# Altium schematic sheet CAMAC_v2.SchDoc
size A3
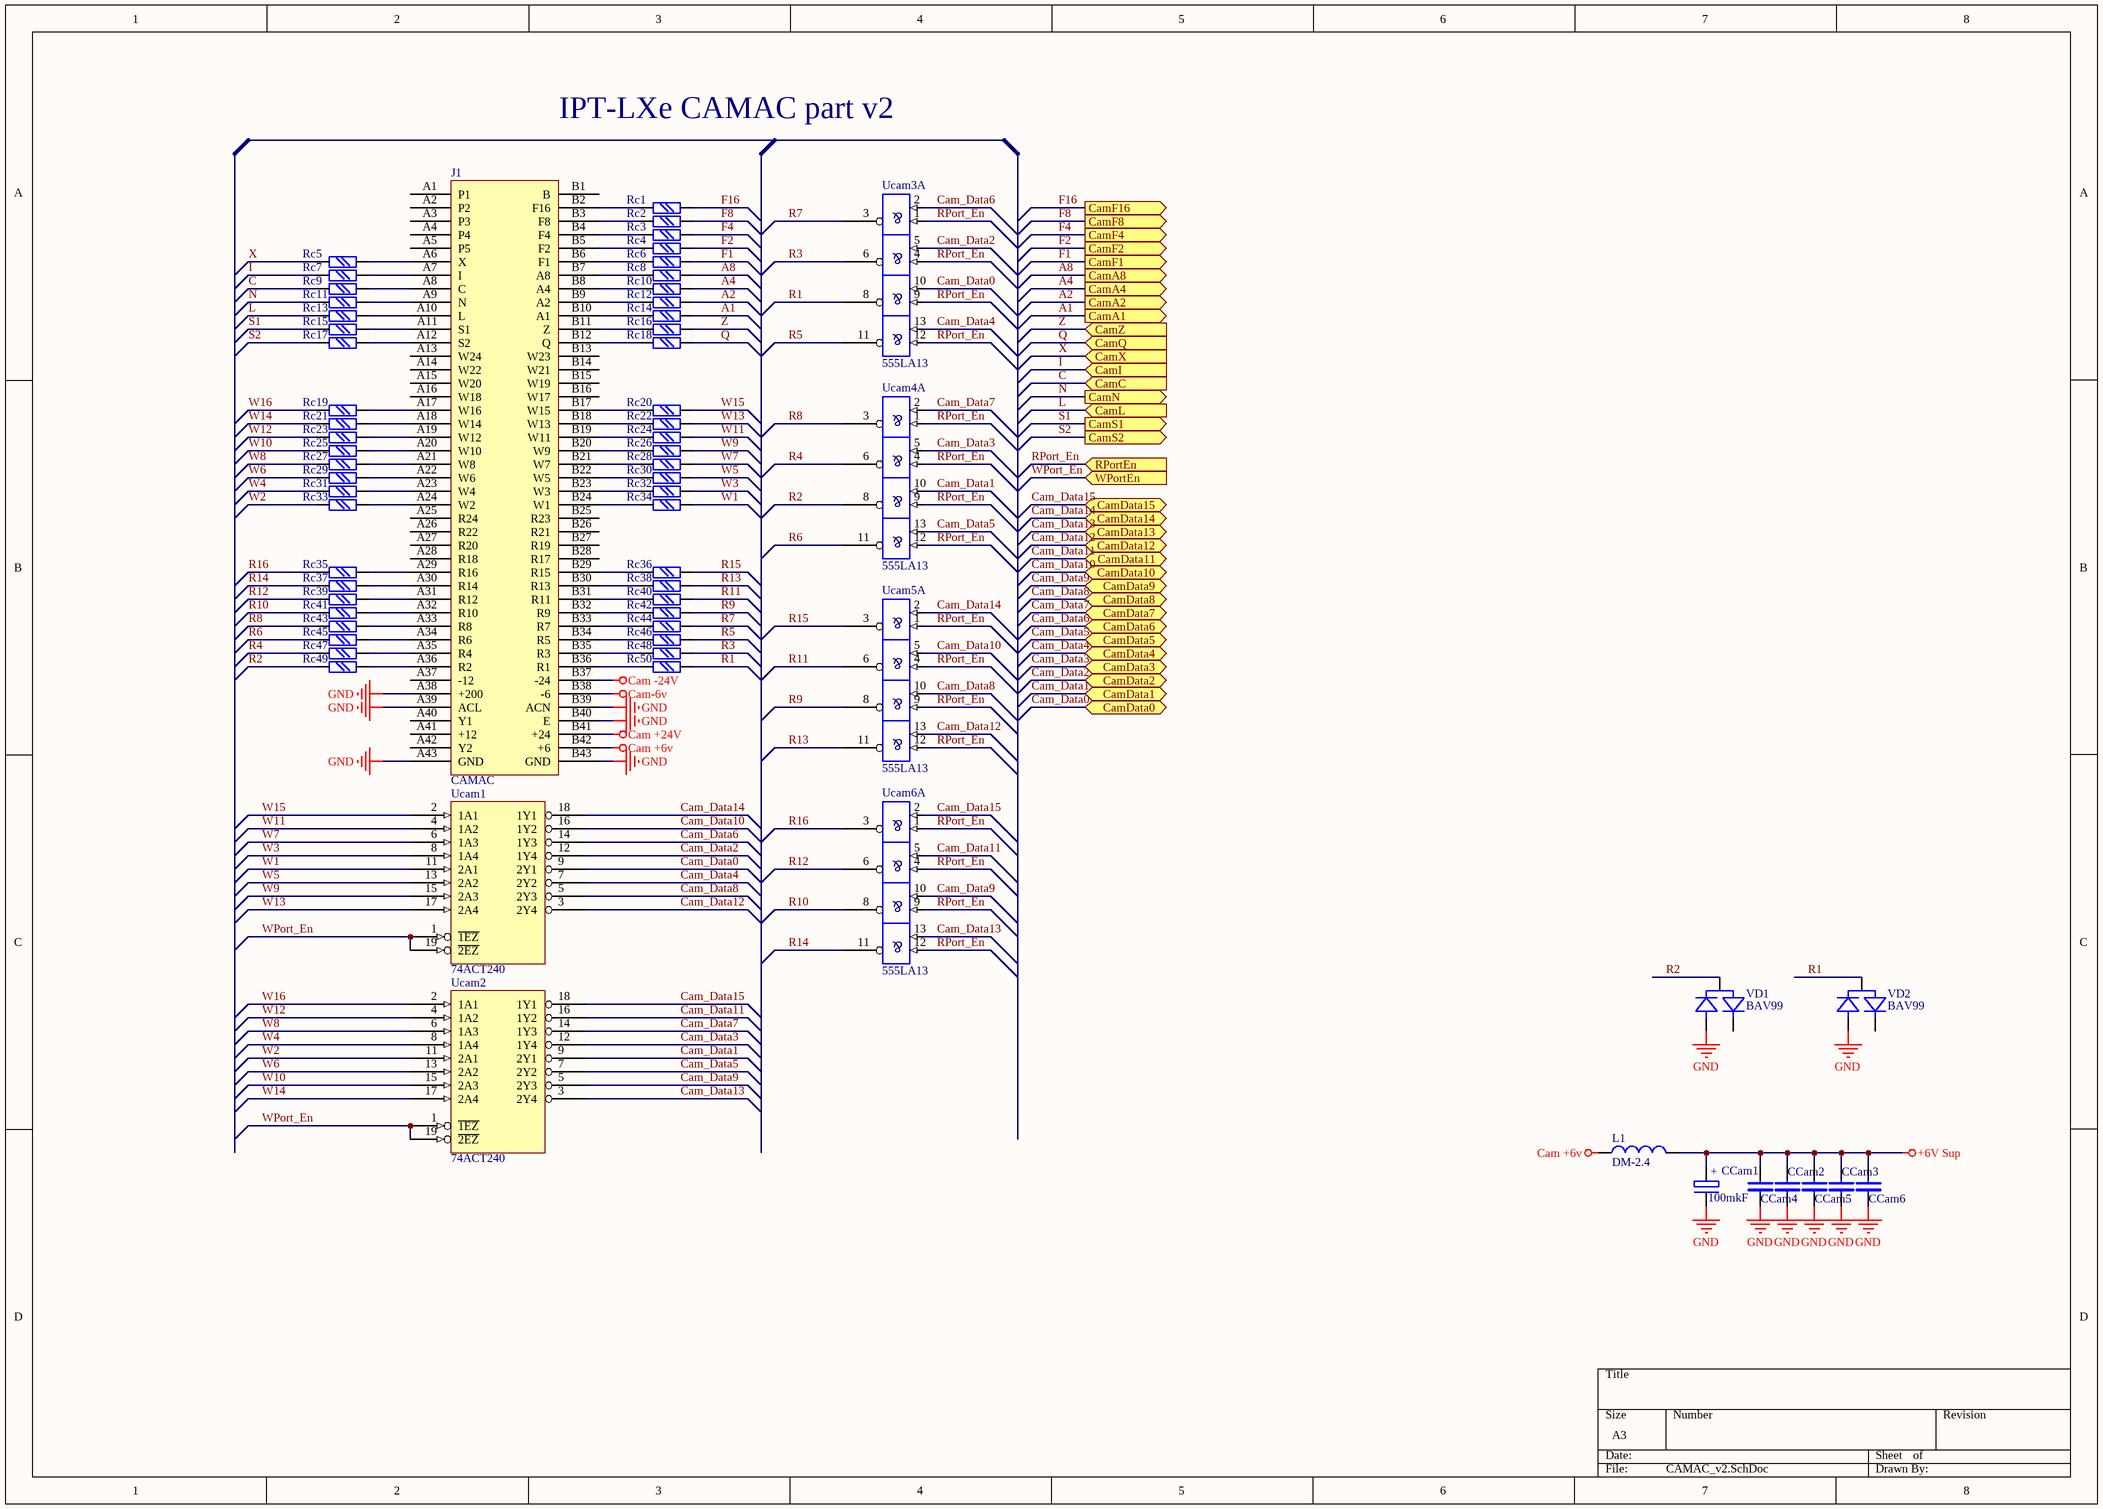
[diagram p0: CAMAC_v2.SchDoc]

## Parts
CCam1  100mkF  [CEL-SMD300]
CCam2  0.1uF  [chip0805]  (value not drawn)
CCam3  0.1uF  [chip0805]  (value not drawn)
CCam4  0.1uF  [chip0805]  (value not drawn)
CCam5  0.1uF  [chip0805]  (value not drawn)
CCam6  0.1uF  [chip0805]  (value not drawn)
J1  CAMAC  [CAMAC - duplicate]
L1  DM-2.4  [DM-2.4]
Rc1  R  [chip0805]  (value not drawn)
Rc2  R  [chip0805]  (value not drawn)
Rc3  R  [chip0805]  (value not drawn)
Rc4  R  [chip0805]  (value not drawn)
Rc5  R  [chip0805]  (value not drawn)
Rc6  R  [chip0805]  (value not drawn)
Rc7  R  [chip0805]  (value not drawn)
Rc8  R  [chip0805]  (value not drawn)
Rc9  R  [chip0805]  (value not drawn)
Rc10  R  [chip0805]  (value not drawn)
Rc11  R  [chip0805]  (value not drawn)
Rc12  R  [chip0805]  (value not drawn)
Rc13  R  [chip0805]  (value not drawn)
Rc14  R  [chip0805]  (value not drawn)
Rc15  R  [chip0805]  (value not drawn)
Rc16  R  [chip0805]  (value not drawn)
Rc17  R  [chip0805]  (value not drawn)
Rc18  R  [chip0805]  (value not drawn)
Rc19  R  [chip0805]  (value not drawn)
Rc20  R  [chip0805]  (value not drawn)
Rc21  R  [chip0805]  (value not drawn)
Rc22  R  [chip0805]  (value not drawn)
Rc23  R  [chip0805]  (value not drawn)
Rc24  R  [chip0805]  (value not drawn)
Rc25  R  [chip0805]  (value not drawn)
Rc26  R  [chip0805]  (value not drawn)
Rc27  R  [chip0805]  (value not drawn)
Rc28  R  [chip0805]  (value not drawn)
Rc29  R  [chip0805]  (value not drawn)
Rc30  R  [chip0805]  (value not drawn)
Rc31  R  [chip0805]  (value not drawn)
Rc32  R  [chip0805]  (value not drawn)
Rc33  R  [chip0805]  (value not drawn)
Rc34  R  [chip0805]  (value not drawn)
Rc35  R  [chip0805]  (value not drawn)
Rc36  R  [chip0805]  (value not drawn)
Rc37  R  [chip0805]  (value not drawn)
Rc38  R  [chip0805]  (value not drawn)
Rc39  R  [chip0805]  (value not drawn)
Rc40  R  [chip0805]  (value not drawn)
Rc41  R  [chip0805]  (value not drawn)
Rc42  R  [chip0805]  (value not drawn)
Rc43  R  [chip0805]  (value not drawn)
Rc44  R  [chip0805]  (value not drawn)
Rc45  R  [chip0805]  (value not drawn)
Rc46  R  [chip0805]  (value not drawn)
Rc47  R  [chip0805]  (value not drawn)
Rc48  R  [chip0805]  (value not drawn)
Rc49  R  [chip0805]  (value not drawn)
Rc50  R  [chip0805]  (value not drawn)
Ucam1  74ACT240  [20SOIC300]
Ucam2  74ACT240  [20SOIC300]
Ucam3  (no value)  [14DIP300]  (parts A,B,C,D of 4)
Ucam4  (no value)  [14DIP300]  (parts A,B,C,D of 4)
Ucam5  (no value)  [14DIP300]  (parts A,B,C,D of 4)
Ucam6  (no value)  [14DIP300]  (parts A,B,C,D of 4)
VD1  BAV99  [SOT23]
VD2  BAV99  [SOT23]

## Ports
CamA1 (out), CamA2 (out), CamA4 (out), CamA8 (out), CamC (in), CamData0 (bidir), CamData1 (bidir), CamData2 (bidir), CamData3 (bidir), CamData4 (bidir), CamData5 (bidir), CamData6 (bidir), CamData7 (bidir), CamData8 (bidir), CamData9 (bidir), CamData10 (bidir), CamData11 (bidir), CamData12 (bidir), CamData13 (bidir), CamData14 (bidir), CamData15 (bidir), CamF1 (out), CamF2 (out), CamF4 (out), CamF8 (out), CamF16 (out), CamI (in), CamL (in), CamN (out), CamQ (in), CamS1 (out), CamS2 (out), CamX (in), CamZ (in), RPortEn (in), WPortEn (in)

## Nets
+6V Sup: CCam1.+ CCam2.1 CCam3.1 CCam4.1 CCam5.1 CCam6.1 L1.2
Cam +6v: J1.B42(+6) L1.1
Cam +24V: J1.B41(+24)
Cam -24V: J1.B37(-24)
Cam-6v: J1.B38(-6)
GND: CCam1.- CCam2.2 CCam3.2 CCam4.2 CCam5.2 CCam6.2 J1.A38(+200) J1.A39(ACL) J1.A43(GND) J1.B39(ACN) J1.B40(E) J1.B43(GND) Ucam1.10(GND) Ucam2.10(GND) VD1.1 VD2.1
VCC: Ucam1.20(VCC) Ucam2.20(VCC)
A1: Rc14.2 ; port CamA1
A2: Rc12.2 ; port CamA2
A4: Rc10.2 ; port CamA4
A8: Rc8.2 ; port CamA8
C: Rc9.1 ; port CamC
Cam_Data0: Ucam1.9(2Y1) Ucam3.10(I1) ; port CamData0
Cam_Data1: Ucam2.9(2Y1) Ucam4.10(I1) ; port CamData1
Cam_Data2: Ucam1.12(1Y4) Ucam3.5(I1) ; port CamData2
Cam_Data3: Ucam2.12(1Y4) Ucam4.5(I1) ; port CamData3
Cam_Data4: Ucam1.7(2Y2) Ucam3.13(I1) ; port CamData4
Cam_Data5: Ucam2.7(2Y2) Ucam4.13(I1) ; port CamData5
Cam_Data6: Ucam1.14(1Y3) Ucam3.2(I1) ; port CamData6
Cam_Data7: Ucam2.14(1Y3) Ucam4.2(I1) ; port CamData7
Cam_Data8: Ucam1.5(2Y3) Ucam5.10(I1) ; port CamData8
Cam_Data9: Ucam2.5(2Y3) Ucam6.10(I1) ; port CamData9
Cam_Data10: Ucam1.16(1Y2) Ucam5.5(I1) ; port CamData10
Cam_Data11: Ucam2.16(1Y2) Ucam6.5(I1) ; port CamData11
Cam_Data12: Ucam1.3(2Y4) Ucam5.13(I1) ; port CamData12
Cam_Data13: Ucam2.3(2Y4) Ucam6.13(I1) ; port CamData13
Cam_Data14: Ucam1.18(1Y1) Ucam5.2(I1) ; port CamData14
Cam_Data15: Ucam2.18(1Y1) Ucam6.2(I1) ; port CamData15
F1: Rc6.2 ; port CamF1
F2: Rc4.2 ; port CamF2
F4: Rc3.2 ; port CamF4
F8: Rc2.2 ; port CamF8
F16: Rc1.2 ; port CamF16
I: Rc7.1 ; port CamI
L: Rc13.1 ; port CamL
N: Rc11.1 ; port CamN
Q: Rc18.2 ; port CamQ
R1: Rc50.1 Ucam3.8(~{O}) VD2.3
R2: Rc49.1 Ucam4.8(~{O}) VD1.3
R3: Rc48.2 Ucam3.6(~{O})
R4: Rc47.1 Ucam4.6(~{O})
R5: Rc46.2 Ucam3.11(~{O})
R6: Rc45.1 Ucam4.11(~{O})
R7: Rc44.2 Ucam3.3(~{O})
R8: Rc43.1 Ucam4.3(~{O})
R9: Rc42.2 Ucam5.8(~{O})
R10: Rc41.1 Ucam6.8(~{O})
R11: Rc40.2 Ucam5.6(~{O})
R12: Rc39.1 Ucam6.6(~{O})
R13: Rc38.2 Ucam5.11(~{O})
R14: Rc37.1 Ucam6.11(~{O})
R15: Rc36.2 Ucam5.3(~{O})
R16: Rc35.1 Ucam6.3(~{O})
RPort_En: Ucam3.1(I0) Ucam3.4(I0) Ucam3.9(I0) Ucam3.12(I0) Ucam4.1(I0) Ucam4.4(I0) Ucam4.9(I0) Ucam4.12(I0) Ucam5.1(I0) Ucam5.4(I0) Ucam5.9(I0) Ucam5.12(I0) Ucam6.1(I0) Ucam6.4(I0) Ucam6.9(I0) Ucam6.12(I0) ; port RPortEn
S1: Rc15.1 ; port CamS1
S2: Rc17.1 ; port CamS2
W1: Rc34.2 Ucam1.11(2A1)
W2: Rc33.1 Ucam2.11(2A1)
W3: Rc32.2 Ucam1.8(1A4)
W4: Rc31.1 Ucam2.8(1A4)
W5: Rc30.2 Ucam1.13(2A2)
W6: Rc29.1 Ucam2.13(2A2)
W7: Rc28.2 Ucam1.6(1A3)
W8: Rc27.1 Ucam2.6(1A3)
W9: Rc26.2 Ucam1.15(2A3)
W10: Rc25.1 Ucam2.15(2A3)
W11: Rc24.2 Ucam1.4(1A2)
W12: Rc23.1 Ucam2.4(1A2)
W13: Rc22.2 Ucam1.17(2A4)
W14: Rc21.1 Ucam2.17(2A4)
W15: Rc20.2 Ucam1.2(1A1)
W16: Rc19.1 Ucam2.2(1A1)
WPort_En: Ucam1.1(~{1EZ}) Ucam1.19(~{2EZ}) Ucam2.1(~{1EZ}) Ucam2.19(~{2EZ}) ; port WPortEn
X: Rc5.1 ; port CamX
Z: Rc16.2 ; port CamZ
NetJ1_A6: J1.A6(X) Rc5.2
NetJ1_A7: J1.A7(I) Rc7.2
NetJ1_A8: J1.A8(C) Rc9.2
NetJ1_A9: J1.A9(N) Rc11.2
NetJ1_A10: J1.A10(L) Rc13.2
NetJ1_A11: J1.A11(S1) Rc15.2
NetJ1_A12: J1.A12(S2) Rc17.2
NetJ1_A17: J1.A17(W16) Rc19.2
NetJ1_A18: J1.A18(W14) Rc21.2
NetJ1_A19: J1.A19(W12) Rc23.2
NetJ1_A20: J1.A20(W10) Rc25.2
NetJ1_A21: J1.A21(W8) Rc27.2
NetJ1_A22: J1.A22(W6) Rc29.2
NetJ1_A23: J1.A23(W4) Rc31.2
NetJ1_A24: J1.A24(W2) Rc33.2
NetJ1_A29: J1.A29(R16) Rc35.2
NetJ1_A30: J1.A30(R14) Rc37.2
NetJ1_A31: J1.A31(R12) Rc39.2
NetJ1_A32: J1.A32(R10) Rc41.2
NetJ1_A33: J1.A33(R8) Rc43.2
NetJ1_A34: J1.A34(R6) Rc45.2
NetJ1_A35: J1.A35(R4) Rc47.2
NetJ1_A36: J1.A36(R2) Rc49.2
NetJ1_B2: J1.B2(F16) Rc1.1
NetJ1_B3: J1.B3(F8) Rc2.1
NetJ1_B4: J1.B4(F4) Rc3.1
NetJ1_B5: J1.B5(F2) Rc4.1
NetJ1_B6: J1.B6(F1) Rc6.1
NetJ1_B7: J1.B7(A8) Rc8.1
NetJ1_B8: J1.B8(A4) Rc10.1
NetJ1_B9: J1.B9(A2) Rc12.1
NetJ1_B10: J1.B10(A1) Rc14.1
NetJ1_B11: J1.B11(Z) Rc16.1
NetJ1_B12: J1.B12(Q) Rc18.1
NetJ1_B17: J1.B17(W15) Rc20.1
NetJ1_B18: J1.B18(W13) Rc22.1
NetJ1_B19: J1.B19(W11) Rc24.1
NetJ1_B20: J1.B20(W9) Rc26.1
NetJ1_B21: J1.B21(W7) Rc28.1
NetJ1_B22: J1.B22(W5) Rc30.1
NetJ1_B23: J1.B23(W3) Rc32.1
NetJ1_B24: J1.B24(W1) Rc34.1
NetJ1_B29: J1.B29(R15) Rc36.1
NetJ1_B30: J1.B30(R13) Rc38.1
NetJ1_B31: J1.B31(R11) Rc40.1
NetJ1_B32: J1.B32(R9) Rc42.1
NetJ1_B33: J1.B33(R7) Rc44.1
NetJ1_B34: J1.B34(R5) Rc46.1
NetJ1_B35: J1.B35(R3) Rc48.1
NetJ1_B36: J1.B36(R1) Rc50.2

Not connected (* = marked no-connect by the designer): J1 A1(P1) A2(P2) A3(P3) A4(P4) A5(P5) A13(W24) A14(W22) A15(W20) A16(W18) A25(R24) A26(R22) A27(R20) A28(R18) A37(-12) A40(Y1) A41(+12) A42(Y2) B1(B) B13(W23) B14(W21) B15(W19) B16(W17) B25(R23) B26(R21) B27(R19) B28(R17); VD1 2; VD2 2

## Notes on the sheet
- IPT-LXe CAMAC part v2
- (in symbol 555LA13, part A) &
- (in symbol 555LA13, part B) &
- (in symbol 555LA13, part C) &
- (in symbol 555LA13, part D) &

## Library data of the parts
CCam1 = C POL
CCam2-CCam6 = C
J1 = CAMACF
L1 = INDUCTOR
Rc1-Rc50 = R: Text Field1: 20; Text Field2: 20
Ucam1 Ucam2 = 155AP3
Ucam3-Ucam6 = 555LA13: Text Field1: 20; Text Field2: 30
VD1 VD2 = BAV99: Double diode